# Altium schematic sheet WIFI.SchDoc
size A
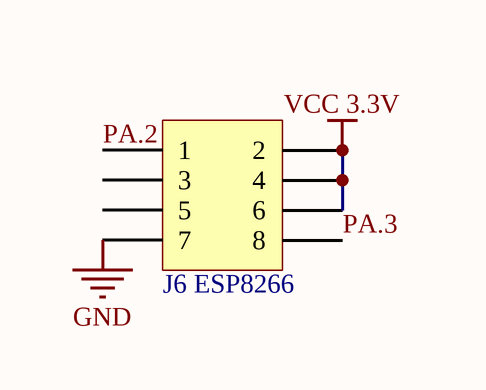
[diagram p0: WIFI.SchDoc]

## Parts
J6_ESP8266  Header 4X2  [HDR2X4]  (value not drawn)

## Nets
GND: J6_ESP8266.7
VCC 3.3V: J6_ESP8266.2 J6_ESP8266.4 J6_ESP8266.6
PA.2: J6_ESP8266.1
PA.3: J6_ESP8266.8

Not connected (* = marked no-connect by the designer): J6_ESP8266 3 5

## Library data of the parts
J6_ESP8266 = Header 4X2: Header, 4-Pin, Dual row; LatestRevisionDate: 17-Jul-2002; LatestRevisionNote: Re-released for DXP Platform.; Publisher: Altium Limited